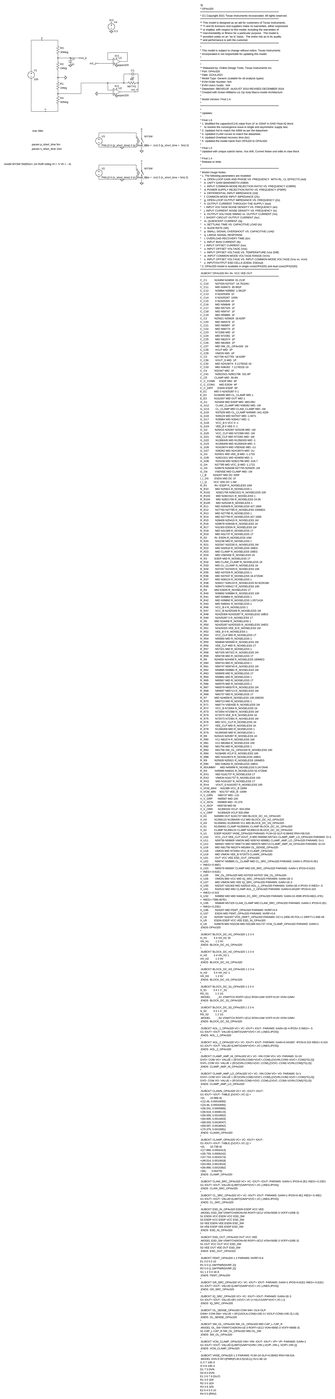
[diagram p0: schematic Isolation_detection_v1.asc, whole sheet]
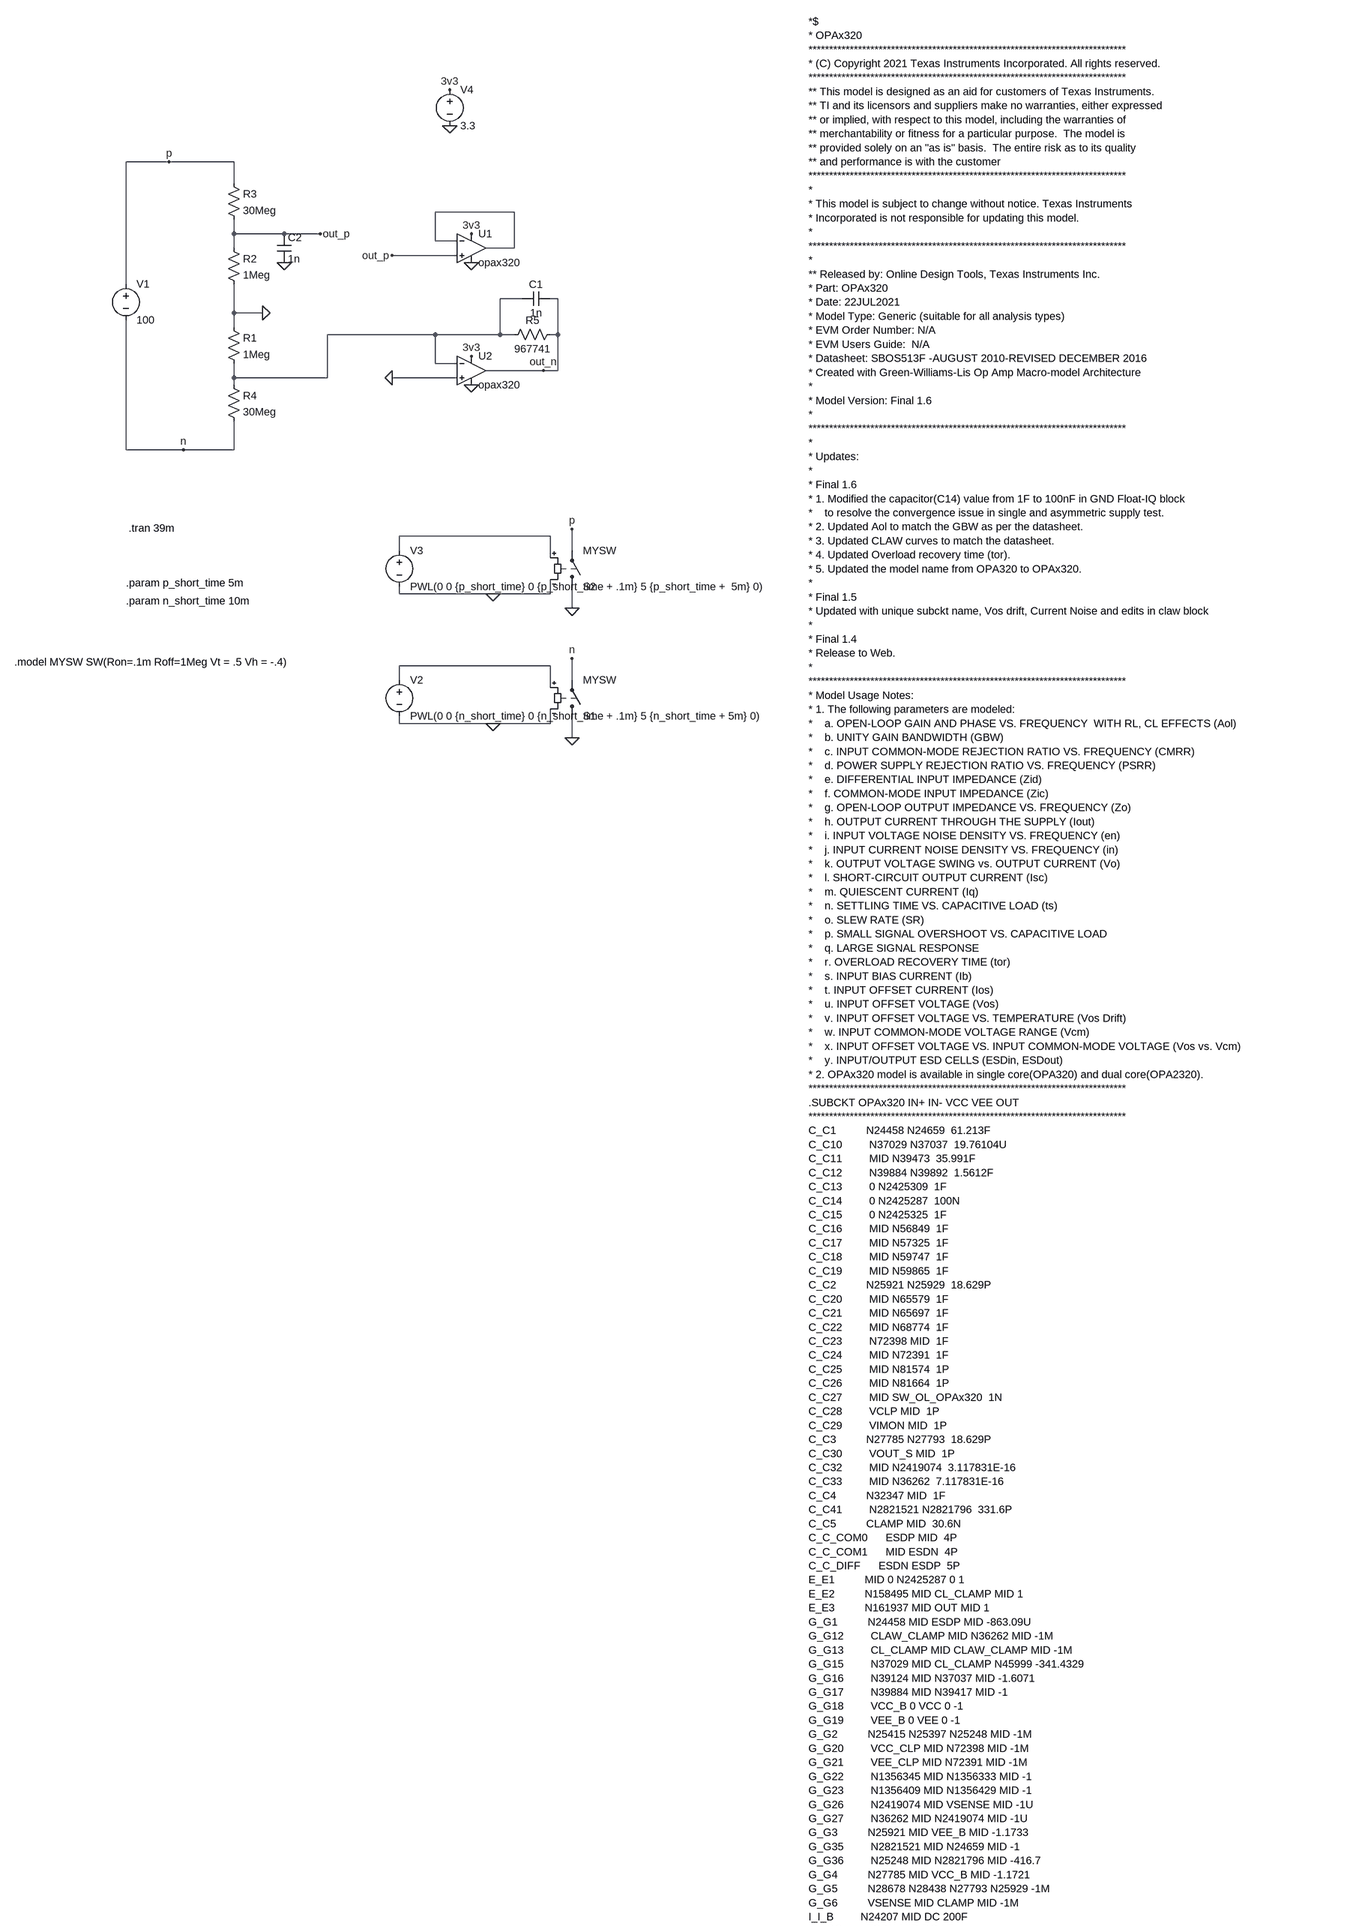
[diagram p1: schematic Isolation_detection_v1.asc, part, row 1 of 3, column 1 of 1]
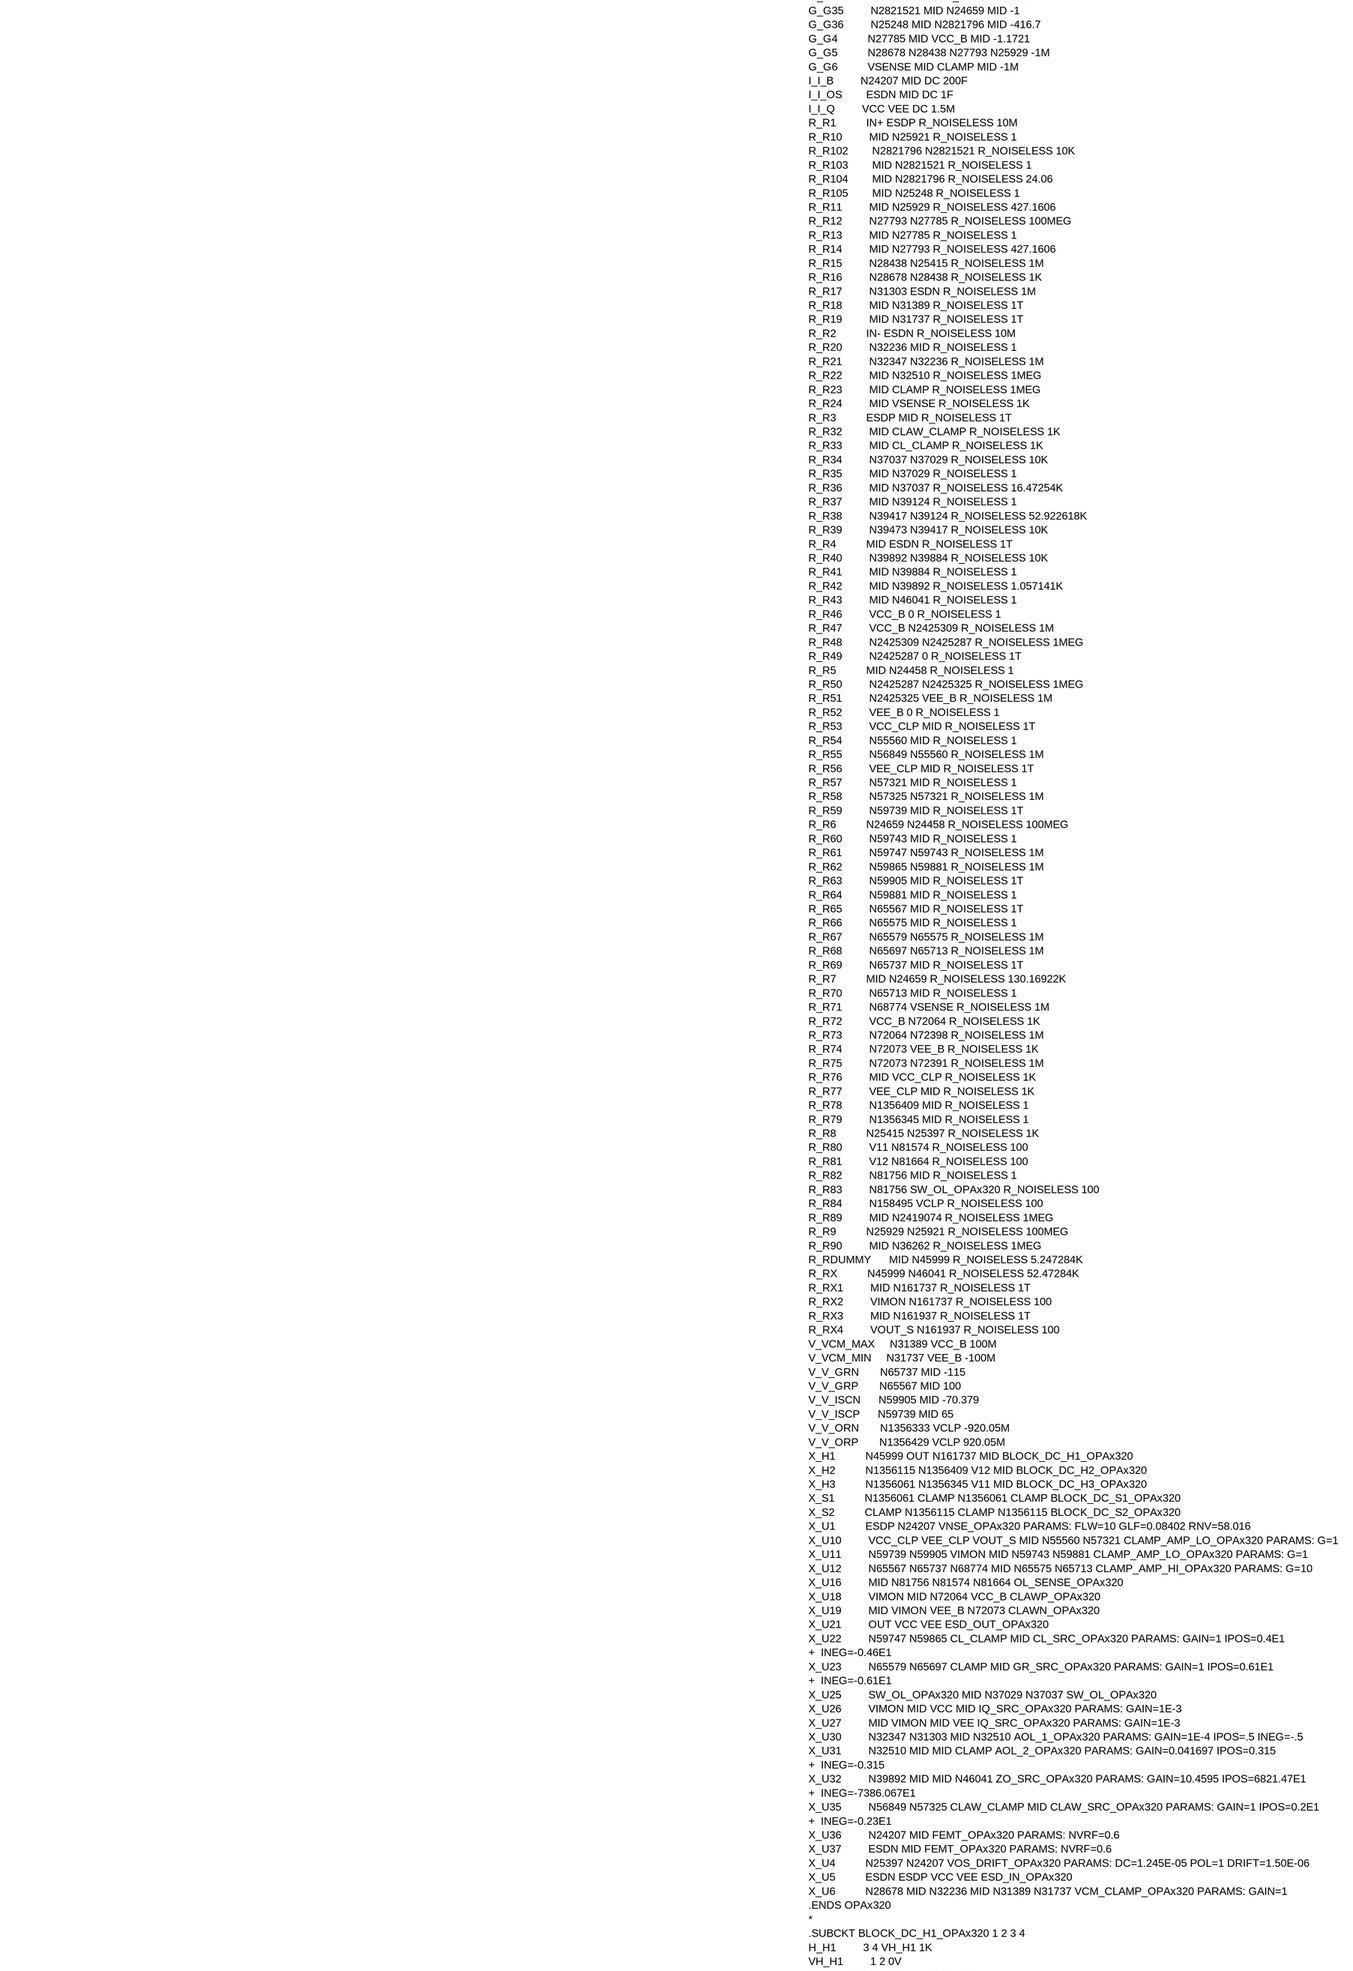
[diagram p2: schematic Isolation_detection_v1.asc, part, row 2 of 3, column 1 of 1]
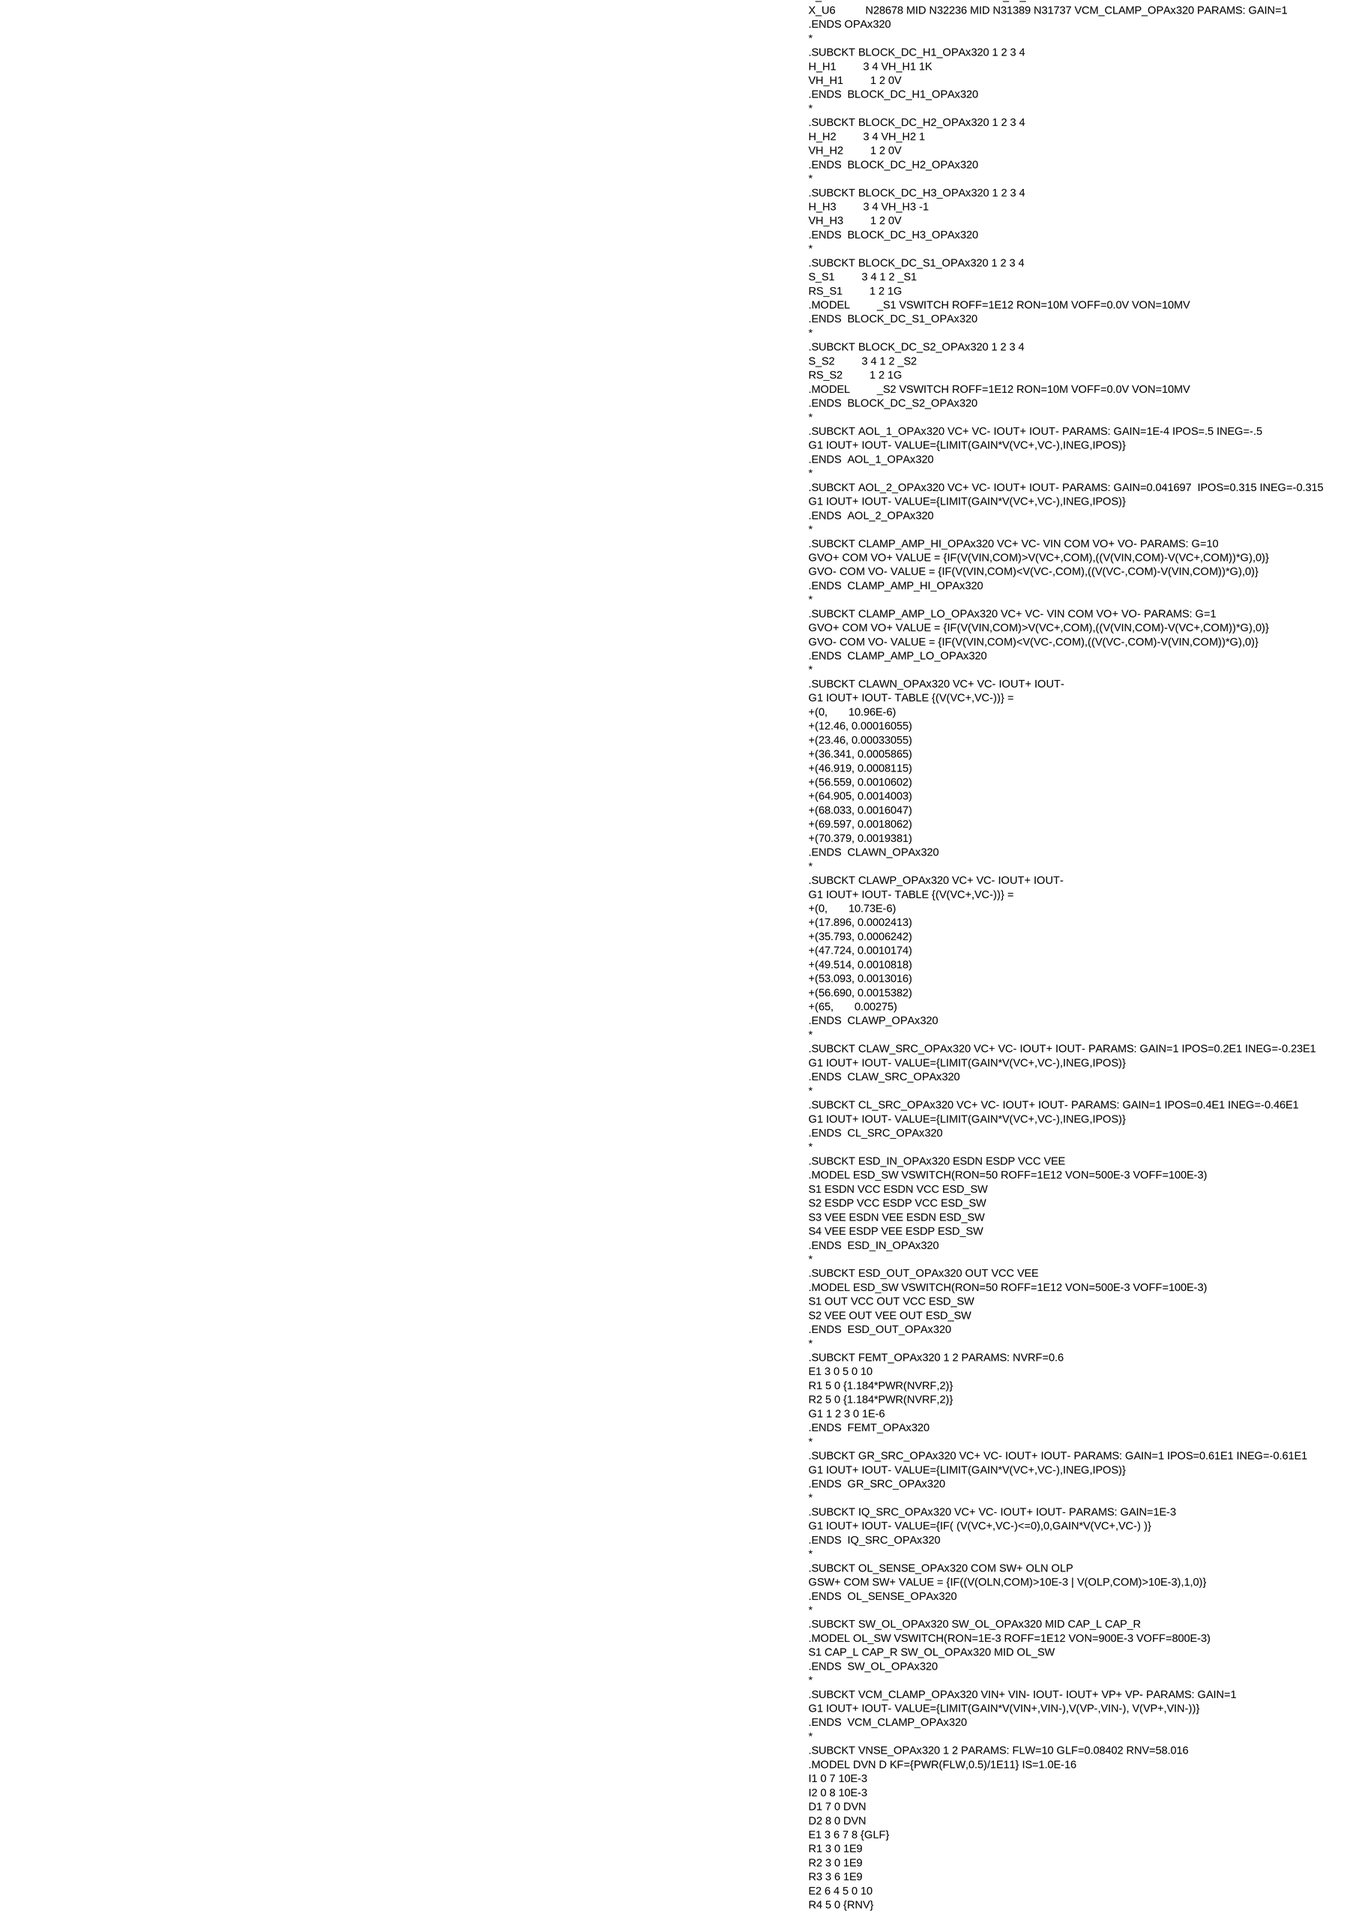
[diagram p3: schematic Isolation_detection_v1.asc, part, row 3 of 3, column 1 of 1]
Isolation_detection_v1.asc, the LTspice schematic file:
Version 4
SHEET 1 3172 11196
WIRE 272 -128 176 -128
WIRE 416 -128 272 -128
WIRE 416 -80 416 -128
WIRE 1040 -16 864 -16
WIRE 416 32 416 0
WIRE 528 32 416 32
WIRE 608 32 528 32
WIRE 864 48 864 -16
WIRE 912 48 864 48
WIRE 416 64 416 32
WIRE 1040 64 1040 -16
WIRE 1040 64 976 64
WIRE 912 80 768 80
WIRE 176 144 176 -128
WIRE 1056 176 1008 176
WIRE 1136 176 1120 176
WIRE 416 208 416 144
WIRE 480 208 416 208
WIRE 416 240 416 208
WIRE 864 256 624 256
WIRE 1008 256 1008 176
WIRE 1008 256 864 256
WIRE 1040 256 1008 256
WIRE 1136 256 1136 176
WIRE 1136 256 1120 256
WIRE 864 320 864 256
WIRE 912 320 864 320
WIRE 1104 336 976 336
WIRE 1136 336 1136 256
WIRE 1136 336 1104 336
WIRE 416 352 416 320
WIRE 624 352 624 256
WIRE 624 352 416 352
WIRE 912 352 768 352
WIRE 416 368 416 352
WIRE 176 512 176 224
WIRE 304 512 176 512
WIRE 416 512 416 448
WIRE 416 512 304 512
WIRE 1120 704 784 704
WIRE 784 736 784 704
WIRE 1168 736 1168 688
WIRE 1120 752 1120 704
WIRE 784 832 784 816
WIRE 992 832 784 832
WIRE 1120 832 1120 800
WIRE 1120 832 992 832
WIRE 1168 864 1168 816
WIRE 1120 992 784 992
WIRE 784 1024 784 992
WIRE 1168 1024 1168 976
WIRE 1120 1040 1120 992
WIRE 784 1120 784 1104
WIRE 992 1120 784 1120
WIRE 1120 1120 1120 1088
WIRE 1120 1120 992 1120
WIRE 1168 1152 1168 1104
FLAG 480 208 0
FLAG 608 32 out_p
FLAG 992 1120 0
FLAG 1168 1152 0
FLAG 992 832 0
FLAG 1168 864 0
FLAG 272 -128 p
FLAG 304 512 n
FLAG 1168 688 p
FLAG 1168 976 n
FLAG 944 96 0
FLAG 768 80 out_p
FLAG 896 -208 0
FLAG 896 -288 3v3
FLAG 944 32 3v3
FLAG 944 368 0
FLAG 944 304 3v3
FLAG 1104 336 out_n
FLAG 768 352 0
FLAG 528 96 0
SYMBOL voltage 176 128 R0
WINDOW 123 0 0 Left 0
WINDOW 39 0 0 Left 0
SYMATTR InstName V1
SYMATTR Value 100
SYMBOL res 400 224 R0
SYMATTR InstName R1
SYMATTR Value 1Meg
SYMBOL res 400 48 R0
SYMATTR InstName R2
SYMATTR Value 1Meg
SYMBOL res 400 -96 R0
SYMATTR InstName R3
SYMATTR Value 30Meg
SYMBOL res 400 352 R0
SYMATTR InstName R4
SYMATTR Value 30Meg
SYMBOL sw 1168 1120 M180
SYMATTR InstName S1
SYMATTR Value MYSW
SYMBOL voltage 784 1008 R0
WINDOW 123 0 0 Left 0
WINDOW 39 0 0 Left 0
SYMATTR InstName V2
SYMATTR Value PWL(0 0 {n_short_time} 0 {n_short_time + .1m} 5 {n_short_time + 5m} 0)
SYMBOL sw 1168 832 M180
SYMATTR InstName S2
SYMATTR Value MYSW
SYMBOL voltage 784 720 R0
WINDOW 123 0 0 Left 0
WINDOW 39 0 0 Left 0
SYMATTR InstName V3
SYMATTR Value PWL(0 0 {p_short_time} 0 {p_short_time + .1m} 5 {p_short_time +  5m} 0)
SYMBOL Opamps\\opamp2 944 0 R0
SYMATTR InstName U1
SYMATTR Value opax320
SYMBOL voltage 896 -304 R0
WINDOW 123 0 0 Left 0
WINDOW 39 0 0 Left 0
SYMATTR InstName V4
SYMATTR Value 3.3
SYMBOL Opamps\\opamp2 944 272 R0
SYMATTR InstName U2
SYMATTR Value opax320
SYMBOL res 1136 240 R90
WINDOW 0 0 56 VBottom 2
WINDOW 3 32 56 VTop 2
SYMATTR InstName R5
SYMATTR Value 967741
SYMBOL cap 512 32 R0
SYMATTR InstName C2
SYMATTR Value 1n
SYMBOL cap 1120 160 R90
WINDOW 0 0 32 VBottom 2
WINDOW 3 32 32 VTop 2
SYMATTR InstName C1
SYMATTR Value 1n
TEXT 182 686 Left 2 !.tran 39m
TEXT -72 984 Left 2 !.model MYSW SW(Ron=.1m Roff=1Meg Vt = .5 Vh = -.4)
TEXT 176 808 Left 2 !.param p_short_time 5m
TEXT 176 848 Left 2 !.param n_short_time 10m
TEXT 1904 -440 Left 2 !*$\n* OPAx320\n*****************************************************************************\n* (C) Copyright 2021 Texas Instruments Incorporated. All rights reserved.                                            \n*****************************************************************************\n** This model is designed as an aid for customers of Texas Instruments.\n** TI and its licensors and suppliers make no warranties, either expressed\n** or implied, with respect to this model, including the warranties of \n** merchantability or fitness for a particular purpose.  The model is\n** provided solely on an "as is" basis.  The entire risk as to its quality\n** and performance is with the customer\n*****************************************************************************\n*\n* This model is subject to change without notice. Texas Instruments\n* Incorporated is not responsible for updating this model.\n*\n*****************************************************************************\n*\n** Released by: Online Design Tools, Texas Instruments Inc.\n* Part: OPAx320\n* Date: 22JUL2021\n* Model Type: Generic (suitable for all analysis types)\n* EVM Order Number: N/A \n* EVM Users Guide:  N/A \n* Datasheet: SBOS513F -AUGUST 2010-REVISED DECEMBER 2016\n* Created with Green-Williams-Lis Op Amp Macro-model Architecture\n*\n* Model Version: Final 1.6\n*\n*****************************************************************************\n*\n* Updates:\n*\n* Final 1.6\n* 1. Modified the capacitor(C14) value from 1F to 100nF in GND Float-IQ block  \n*    to resolve the convergence issue in single and asymmetric supply test.\n* 2. Updated Aol to match the GBW as per the datasheet.\n* 3. Updated CLAW curves to match the datasheet.\n* 4. Updated Overload recovery time (tor).\n* 5. Updated the model name from OPA320 to OPAx320.\n*\n* Final 1.5\n* Updated with unique subckt name, Vos drift, Current Noise and edits in claw block\n*\n* Final 1.4\n* Release to Web.\n*\n*****************************************************************************\n* Model Usage Notes:\n* 1. The following parameters are modeled: \n*    a. OPEN-LOOP GAIN AND PHASE VS. FREQUENCY  WITH RL, CL EFFECTS (Aol)\n*    b. UNITY GAIN BANDWIDTH (GBW)\n*    c. INPUT COMMON-MODE REJECTION RATIO VS. FREQUENCY (CMRR)\n*    d. POWER SUPPLY REJECTION RATIO VS. FREQUENCY (PSRR)\n*    e. DIFFERENTIAL INPUT IMPEDANCE (Zid)\n*    f. COMMON-MODE INPUT IMPEDANCE (Zic)\n*    g. OPEN-LOOP OUTPUT IMPEDANCE VS. FREQUENCY (Zo)\n*    h. OUTPUT CURRENT THROUGH THE SUPPLY (Iout)\n*    i. INPUT VOLTAGE NOISE DENSITY VS. FREQUENCY (en)\n*    j. INPUT CURRENT NOISE DENSITY VS. FREQUENCY (in)\n*    k. OUTPUT VOLTAGE SWING vs. OUTPUT CURRENT (Vo)\n*    l. SHORT-CIRCUIT OUTPUT CURRENT (Isc)\n*    m. QUIESCENT CURRENT (Iq)\n*    n. SETTLING TIME VS. CAPACITIVE LOAD (ts)\n*    o. SLEW RATE (SR)\n*    p. SMALL SIGNAL OVERSHOOT VS. CAPACITIVE LOAD\n*    q. LARGE SIGNAL RESPONSE\n*    r. OVERLOAD RECOVERY TIME (tor)\n*    s. INPUT BIAS CURRENT (Ib)\n*    t. INPUT OFFSET CURRENT (Ios)\n*    u. INPUT OFFSET VOLTAGE (Vos)\n*    v. INPUT OFFSET VOLTAGE VS. TEMPERATURE (Vos Drift)\n*    w. INPUT COMMON-MODE VOLTAGE RANGE (Vcm)\n*    x. INPUT OFFSET VOLTAGE VS. INPUT COMMON-MODE VOLTAGE (Vos vs. Vcm)\n*    y. INPUT/OUTPUT ESD CELLS (ESDin, ESDout)\n* 2. OPAx320 model is available in single core(OPA320) and dual core(OPA2320). \n*****************************************************************************\n.SUBCKT OPAx320 IN+ IN- VCC VEE OUT  \n*****************************************************************************\nC_C1          N24458 N24659  61.213F   \nC_C10         N37029 N37037  19.76104U   \nC_C11         MID N39473  35.991F   \nC_C12         N39884 N39892  1.5612F   \nC_C13         0 N2425309  1F   \nC_C14         0 N2425287  100N   \nC_C15         0 N2425325  1F   \nC_C16         MID N56849  1F   \nC_C17         MID N57325  1F   \nC_C18         MID N59747  1F   \nC_C19         MID N59865  1F   \nC_C2          N25921 N25929  18.629P   \nC_C20         MID N65579  1F   \nC_C21         MID N65697  1F   \nC_C22         MID N68774  1F   \nC_C23         N72398 MID  1F   \nC_C24         MID N72391  1F   \nC_C25         MID N81574  1P   \nC_C26         MID N81664  1P   \nC_C27         MID SW_OL_OPAx320  1N   \nC_C28         VCLP MID  1P   \nC_C29         VIMON MID  1P   \nC_C3          N27785 N27793  18.629P   \nC_C30         VOUT_S MID  1P   \nC_C32         MID N2419074  3.117831E-16   \nC_C33         MID N36262  7.117831E-16   \nC_C4          N32347 MID  1F   \nC_C41         N2821521 N2821796  331.6P   \nC_C5          CLAMP MID  30.6N   \nC_C_COM0      ESDP MID  4P   \nC_C_COM1      MID ESDN  4P   \nC_C_DIFF      ESDN ESDP  5P   \nE_E1          MID 0 N2425287 0 1\nE_E2          N158495 MID CL_CLAMP MID 1\nE_E3          N161937 MID OUT MID 1\nG_G1          N24458 MID ESDP MID -863.09U\nG_G12         CLAW_CLAMP MID N36262 MID -1M\nG_G13         CL_CLAMP MID CLAW_CLAMP MID -1M\nG_G15         N37029 MID CL_CLAMP N45999 -341.4329\nG_G16         N39124 MID N37037 MID -1.6071\nG_G17         N39884 MID N39417 MID -1\nG_G18         VCC_B 0 VCC 0 -1\nG_G19         VEE_B 0 VEE 0 -1\nG_G2          N25415 N25397 N25248 MID -1M\nG_G20         VCC_CLP MID N72398 MID -1M\nG_G21         VEE_CLP MID N72391 MID -1M\nG_G22         N1356345 MID N1356333 MID -1\nG_G23         N1356409 MID N1356429 MID -1\nG_G26         N2419074 MID VSENSE MID -1U\nG_G27         N36262 MID N2419074 MID -1U\nG_G3          N25921 MID VEE_B MID -1.1733\nG_G35         N2821521 MID N24659 MID -1\nG_G36         N25248 MID N2821796 MID -416.7\nG_G4          N27785 MID VCC_B MID -1.1721\nG_G5          N28678 N28438 N27793 N25929 -1M\nG_G6          VSENSE MID CLAMP MID -1M\nI_I_B         N24207 MID DC 200F  \nI_I_OS        ESDN MID DC 1F  \nI_I_Q         VCC VEE DC 1.5M  \nR_R1          IN+ ESDP R_NOISELESS 10M\nR_R10         MID N25921 R_NOISELESS 1\nR_R102        N2821796 N2821521 R_NOISELESS 10K\nR_R103        MID N2821521 R_NOISELESS 1\nR_R104        MID N2821796 R_NOISELESS 24.06\nR_R105        MID N25248 R_NOISELESS 1\nR_R11         MID N25929 R_NOISELESS 427.1606\nR_R12         N27793 N27785 R_NOISELESS 100MEG\nR_R13         MID N27785 R_NOISELESS 1\nR_R14         MID N27793 R_NOISELESS 427.1606\nR_R15         N28438 N25415 R_NOISELESS 1M\nR_R16         N28678 N28438 R_NOISELESS 1K\nR_R17         N31303 ESDN R_NOISELESS 1M\nR_R18         MID N31389 R_NOISELESS 1T\nR_R19         MID N31737 R_NOISELESS 1T\nR_R2          IN- ESDN R_NOISELESS 10M\nR_R20         N32236 MID R_NOISELESS 1\nR_R21         N32347 N32236 R_NOISELESS 1M\nR_R22         MID N32510 R_NOISELESS 1MEG\nR_R23         MID CLAMP R_NOISELESS 1MEG\nR_R24         MID VSENSE R_NOISELESS 1K\nR_R3          ESDP MID R_NOISELESS 1T\nR_R32         MID CLAW_CLAMP R_NOISELESS 1K\nR_R33         MID CL_CLAMP R_NOISELESS 1K\nR_R34         N37037 N37029 R_NOISELESS 10K\nR_R35         MID N37029 R_NOISELESS 1\nR_R36         MID N37037 R_NOISELESS 16.47254K\nR_R37         MID N39124 R_NOISELESS 1\nR_R38         N39417 N39124 R_NOISELESS 52.922618K\nR_R39         N39473 N39417 R_NOISELESS 10K\nR_R4          MID ESDN R_NOISELESS 1T\nR_R40         N39892 N39884 R_NOISELESS 10K\nR_R41         MID N39884 R_NOISELESS 1\nR_R42         MID N39892 R_NOISELESS 1.057141K\nR_R43         MID N46041 R_NOISELESS 1\nR_R46         VCC_B 0 R_NOISELESS 1\nR_R47         VCC_B N2425309 R_NOISELESS 1M\nR_R48         N2425309 N2425287 R_NOISELESS 1MEG\nR_R49         N2425287 0 R_NOISELESS 1T\nR_R5          MID N24458 R_NOISELESS 1\nR_R50         N2425287 N2425325 R_NOISELESS 1MEG\nR_R51         N2425325 VEE_B R_NOISELESS 1M\nR_R52         VEE_B 0 R_NOISELESS 1\nR_R53         VCC_CLP MID R_NOISELESS 1T\nR_R54         N55560 MID R_NOISELESS 1\nR_R55         N56849 N55560 R_NOISELESS 1M\nR_R56         VEE_CLP MID R_NOISELESS 1T\nR_R57         N57321 MID R_NOISELESS 1\nR_R58         N57325 N57321 R_NOISELESS 1M\nR_R59         N59739 MID R_NOISELESS 1T\nR_R6          N24659 N24458 R_NOISELESS 100MEG\nR_R60         N59743 MID R_NOISELESS 1\nR_R61         N59747 N59743 R_NOISELESS 1M\nR_R62         N59865 N59881 R_NOISELESS 1M\nR_R63         N59905 MID R_NOISELESS 1T\nR_R64         N59881 MID R_NOISELESS 1\nR_R65         N65567 MID R_NOISELESS 1T\nR_R66         N65575 MID R_NOISELESS 1\nR_R67         N65579 N65575 R_NOISELESS 1M\nR_R68         N65697 N65713 R_NOISELESS 1M\nR_R69         N65737 MID R_NOISELESS 1T\nR_R7          MID N24659 R_NOISELESS 130.16922K\nR_R70         N65713 MID R_NOISELESS 1\nR_R71         N68774 VSENSE R_NOISELESS 1M\nR_R72         VCC_B N72064 R_NOISELESS 1K\nR_R73         N72064 N72398 R_NOISELESS 1M\nR_R74         N72073 VEE_B R_NOISELESS 1K\nR_R75         N72073 N72391 R_NOISELESS 1M\nR_R76         MID VCC_CLP R_NOISELESS 1K\nR_R77         VEE_CLP MID R_NOISELESS 1K\nR_R78         N1356409 MID R_NOISELESS 1\nR_R79         N1356345 MID R_NOISELESS 1\nR_R8          N25415 N25397 R_NOISELESS 1K\nR_R80         V11 N81574 R_NOISELESS 100\nR_R81         V12 N81664 R_NOISELESS 100\nR_R82         N81756 MID R_NOISELESS 1\nR_R83         N81756 SW_OL_OPAx320 R_NOISELESS 100\nR_R84         N158495 VCLP R_NOISELESS 100\nR_R89         MID N2419074 R_NOISELESS 1MEG\nR_R9          N25929 N25921 R_NOISELESS 100MEG\nR_R90         MID N36262 R_NOISELESS 1MEG\nR_RDUMMY      MID N45999 R_NOISELESS 5.247284K\nR_RX          N45999 N46041 R_NOISELESS 52.47284K\nR_RX1         MID N161737 R_NOISELESS 1T\nR_RX2         VIMON N161737 R_NOISELESS 100\nR_RX3         MID N161937 R_NOISELESS 1T\nR_RX4         VOUT_S N161937 R_NOISELESS 100\nV_VCM_MAX     N31389 VCC_B 100M\nV_VCM_MIN     N31737 VEE_B -100M\nV_V_GRN       N65737 MID -115\nV_V_GRP       N65567 MID 100\nV_V_ISCN      N59905 MID -70.379\nV_V_ISCP      N59739 MID 65\nV_V_ORN       N1356333 VCLP -920.05M\nV_V_ORP       N1356429 VCLP 920.05M\nX_H1          N45999 OUT N161737 MID BLOCK_DC_H1_OPAx320 \nX_H2          N1356115 N1356409 V12 MID BLOCK_DC_H2_OPAx320 \nX_H3          N1356061 N1356345 V11 MID BLOCK_DC_H3_OPAx320 \nX_S1          N1356061 CLAMP N1356061 CLAMP BLOCK_DC_S1_OPAx320 \nX_S2          CLAMP N1356115 CLAMP N1356115 BLOCK_DC_S2_OPAx320  \nX_U1          ESDP N24207 VNSE_OPAx320 PARAMS: FLW=10 GLF=0.08402 RNV=58.016\nX_U10         VCC_CLP VEE_CLP VOUT_S MID N55560 N57321 CLAMP_AMP_LO_OPAx320 PARAMS: G=1\nX_U11         N59739 N59905 VIMON MID N59743 N59881 CLAMP_AMP_LO_OPAx320 PARAMS: G=1\nX_U12         N65567 N65737 N68774 MID N65575 N65713 CLAMP_AMP_HI_OPAx320 PARAMS: G=10\nX_U16         MID N81756 N81574 N81664 OL_SENSE_OPAx320\nX_U18         VIMON MID N72064 VCC_B CLAWP_OPAx320\nX_U19         MID VIMON VEE_B N72073 CLAWN_OPAx320\nX_U21         OUT VCC VEE ESD_OUT_OPAx320\nX_U22         N59747 N59865 CL_CLAMP MID CL_SRC_OPAx320 PARAMS: GAIN=1 IPOS=0.4E1\n+  INEG=-0.46E1\nX_U23         N65579 N65697 CLAMP MID GR_SRC_OPAx320 PARAMS: GAIN=1 IPOS=0.61E1\n+  INEG=-0.61E1\nX_U25         SW_OL_OPAx320 MID N37029 N37037 SW_OL_OPAx320\nX_U26         VIMON MID VCC MID IQ_SRC_OPAx320 PARAMS: GAIN=1E-3\nX_U27         MID VIMON MID VEE IQ_SRC_OPAx320 PARAMS: GAIN=1E-3\nX_U30         N32347 N31303 MID N32510 AOL_1_OPAx320 PARAMS: GAIN=1E-4 IPOS=.5 INEG=-.5\nX_U31         N32510 MID MID CLAMP AOL_2_OPAx320 PARAMS: GAIN=0.041697 IPOS=0.315\n+  INEG=-0.315\nX_U32         N39892 MID MID N46041 ZO_SRC_OPAx320 PARAMS: GAIN=10.4595 IPOS=6821.47E1\n+  INEG=-7386.067E1\nX_U35         N56849 N57325 CLAW_CLAMP MID CLAW_SRC_OPAx320 PARAMS: GAIN=1 IPOS=0.2E1\n+  INEG=-0.23E1\nX_U36         N24207 MID FEMT_OPAx320 PARAMS: NVRF=0.6\nX_U37         ESDN MID FEMT_OPAx320 PARAMS: NVRF=0.6\nX_U4          N25397 N24207 VOS_DRIFT_OPAx320 PARAMS: DC=1.245E-05 POL=1 DRIFT=1.50E-06\nX_U5          ESDN ESDP VCC VEE ESD_IN_OPAx320\nX_U6          N28678 MID N32236 MID N31389 N31737 VCM_CLAMP_OPAx320 PARAMS: GAIN=1\n.ENDS OPAx320\n*\n.SUBCKT BLOCK_DC_H1_OPAx320 1 2 3 4  \nH_H1         3 4 VH_H1 1K\nVH_H1         1 2 0V\n.ENDS  BLOCK_DC_H1_OPAx320\n*\n.SUBCKT BLOCK_DC_H2_OPAx320 1 2 3 4  \nH_H2         3 4 VH_H2 1\nVH_H2         1 2 0V\n.ENDS  BLOCK_DC_H2_OPAx320\n*\n.SUBCKT BLOCK_DC_H3_OPAx320 1 2 3 4  \nH_H3         3 4 VH_H3 -1\nVH_H3         1 2 0V\n.ENDS  BLOCK_DC_H3_OPAx320\n*\n.SUBCKT BLOCK_DC_S1_OPAx320 1 2 3 4  \nS_S1         3 4 1 2 _S1\nRS_S1         1 2 1G\n.MODEL         _S1 VSWITCH ROFF=1E12 RON=10M VOFF=0.0V VON=10MV\n.ENDS  BLOCK_DC_S1_OPAx320\n*\n.SUBCKT BLOCK_DC_S2_OPAx320 1 2 3 4  \nS_S2         3 4 1 2 _S2\nRS_S2         1 2 1G\n.MODEL         _S2 VSWITCH ROFF=1E12 RON=10M VOFF=0.0V VON=10MV\n.ENDS  BLOCK_DC_S2_OPAx320\n*\n.SUBCKT AOL_1_OPAx320 VC+ VC- IOUT+ IOUT- PARAMS: GAIN=1E-4 IPOS=.5 INEG=-.5\nG1 IOUT+ IOUT- VALUE={LIMIT(GAIN*V(VC+,VC-),INEG,IPOS)}\n.ENDS  AOL_1_OPAx320\n*\n.SUBCKT AOL_2_OPAx320 VC+ VC- IOUT+ IOUT- PARAMS: GAIN=0.041697  IPOS=0.315 INEG=-0.315\nG1 IOUT+ IOUT- VALUE={LIMIT(GAIN*V(VC+,VC-),INEG,IPOS)}\n.ENDS  AOL_2_OPAx320\n*\n.SUBCKT CLAMP_AMP_HI_OPAx320 VC+ VC- VIN COM VO+ VO- PARAMS: G=10\nGVO+ COM VO+ VALUE = {IF(V(VIN,COM)>V(VC+,COM),((V(VIN,COM)-V(VC+,COM))*G),0)}\nGVO- COM VO- VALUE = {IF(V(VIN,COM)<V(VC-,COM),((V(VC-,COM)-V(VIN,COM))*G),0)}\n.ENDS  CLAMP_AMP_HI_OPAx320\n*\n.SUBCKT CLAMP_AMP_LO_OPAx320 VC+ VC- VIN COM VO+ VO- PARAMS: G=1\nGVO+ COM VO+ VALUE = {IF(V(VIN,COM)>V(VC+,COM),((V(VIN,COM)-V(VC+,COM))*G),0)}\nGVO- COM VO- VALUE = {IF(V(VIN,COM)<V(VC-,COM),((V(VC-,COM)-V(VIN,COM))*G),0)}\n.ENDS  CLAMP_AMP_LO_OPAx320\n*\n.SUBCKT CLAWN_OPAx320 VC+ VC- IOUT+ IOUT-\nG1 IOUT+ IOUT- TABLE {(V(VC+,VC-))} =\n+(0,       10.96E-6)\n+(12.46, 0.00016055)\n+(23.46, 0.00033055)\n+(36.341, 0.0005865)\n+(46.919, 0.0008115)\n+(56.559, 0.0010602)\n+(64.905, 0.0014003)\n+(68.033, 0.0016047)\n+(69.597, 0.0018062)\n+(70.379, 0.0019381)\n.ENDS  CLAWN_OPAx320\n*\n.SUBCKT CLAWP_OPAx320 VC+ VC- IOUT+ IOUT-\nG1 IOUT+ IOUT- TABLE {(V(VC+,VC-))} =\n+(0,       10.73E-6)\n+(17.896, 0.0002413)\n+(35.793, 0.0006242)\n+(47.724, 0.0010174)\n+(49.514, 0.0010818)\n+(53.093, 0.0013016)\n+(56.690, 0.0015382)\n+(65,       0.00275)\n.ENDS  CLAWP_OPAx320\n*\n.SUBCKT CLAW_SRC_OPAx320 VC+ VC- IOUT+ IOUT- PARAMS: GAIN=1 IPOS=0.2E1 INEG=-0.23E1\nG1 IOUT+ IOUT- VALUE={LIMIT(GAIN*V(VC+,VC-),INEG,IPOS)}\n.ENDS  CLAW_SRC_OPAx320\n*\n.SUBCKT CL_SRC_OPAx320 VC+ VC- IOUT+ IOUT- PARAMS: GAIN=1 IPOS=0.4E1 INEG=-0.46E1\nG1 IOUT+ IOUT- VALUE={LIMIT(GAIN*V(VC+,VC-),INEG,IPOS)}\n.ENDS  CL_SRC_OPAx320\n*\n.SUBCKT ESD_IN_OPAx320 ESDN ESDP VCC VEE\n.MODEL ESD_SW VSWITCH(RON=50 ROFF=1E12 VON=500E-3 VOFF=100E-3)\nS1 ESDN VCC ESDN VCC ESD_SW\nS2 ESDP VCC ESDP VCC ESD_SW\nS3 VEE ESDN VEE ESDN ESD_SW\nS4 VEE ESDP VEE ESDP ESD_SW\n.ENDS  ESD_IN_OPAx320\n*\n.SUBCKT ESD_OUT_OPAx320 OUT VCC VEE\n.MODEL ESD_SW VSWITCH(RON=50 ROFF=1E12 VON=500E-3 VOFF=100E-3)\nS1 OUT VCC OUT VCC ESD_SW\nS2 VEE OUT VEE OUT ESD_SW\n.ENDS  ESD_OUT_OPAx320\n*\n.SUBCKT FEMT_OPAx320 1 2 PARAMS: NVRF=0.6\nE1 3 0 5 0 10\nR1 5 0 {1.184*PWR(NVRF,2)}\nR2 5 0 {1.184*PWR(NVRF,2)}\nG1 1 2 3 0 1E-6\n.ENDS  FEMT_OPAx320\n*\n.SUBCKT GR_SRC_OPAx320 VC+ VC- IOUT+ IOUT- PARAMS: GAIN=1 IPOS=0.61E1 INEG=-0.61E1\nG1 IOUT+ IOUT- VALUE={LIMIT(GAIN*V(VC+,VC-),INEG,IPOS)}\n.ENDS  GR_SRC_OPAx320\n*\n.SUBCKT IQ_SRC_OPAx320 VC+ VC- IOUT+ IOUT- PARAMS: GAIN=1E-3\nG1 IOUT+ IOUT- VALUE={IF( (V(VC+,VC-)<=0),0,GAIN*V(VC+,VC-) )}\n.ENDS  IQ_SRC_OPAx320\n*\n.SUBCKT OL_SENSE_OPAx320 COM SW+ OLN OLP\nGSW+ COM SW+ VALUE = {IF((V(OLN,COM)>10E-3 | V(OLP,COM)>10E-3),1,0)}\n.ENDS  OL_SENSE_OPAx320\n*\n.SUBCKT SW_OL_OPAx320 SW_OL_OPAx320 MID CAP_L CAP_R\n.MODEL OL_SW VSWITCH(RON=1E-3 ROFF=1E12 VON=900E-3 VOFF=800E-3)\nS1 CAP_L CAP_R SW_OL_OPAx320 MID OL_SW\n.ENDS  SW_OL_OPAx320\n*\n.SUBCKT VCM_CLAMP_OPAx320 VIN+ VIN- IOUT- IOUT+ VP+ VP- PARAMS: GAIN=1\nG1 IOUT+ IOUT- VALUE={LIMIT(GAIN*V(VIN+,VIN-),V(VP-,VIN-), V(VP+,VIN-))}\n.ENDS  VCM_CLAMP_OPAx320\n*\n.SUBCKT VNSE_OPAx320 1 2 PARAMS: FLW=10 GLF=0.08402 RNV=58.016\n.MODEL DVN D KF={PWR(FLW,0.5)/1E11} IS=1.0E-16\nI1 0 7 10E-3\nI2 0 8 10E-3\nD1 7 0 DVN\nD2 8 0 DVN\nE1 3 6 7 8 {GLF}\nR1 3 0 1E9\nR2 3 0 1E9\nR3 3 6 1E9\nE2 6 4 5 0 10\nR4 5 0 {RNV}\nR5 5 0 {RNV}\nR6 3 4 1E9\nR7 4 0 1E9\nE3 1 2 3 4 1\n.ENDS  VNSE_OPAx320\n*\n.SUBCKT VOS_DRIFT_OPAx320 VOS+ VOS- PARAMS: DC=1.243E-05 POL=1 DRIFT=1.50E-06\nE1 VOS+ VOS- VALUE={DC+POL*DRIFT*(TEMP-27)}\n.ENDS  VOS_DRIFT_OPAx320\n*\n.SUBCKT ZO_SRC_OPAx320 VC+ VC- IOUT+ IOUT- PARAMS: GAIN=10.4595 IPOS=6821.47E1 INEG=-7386.067E1\nG1 IOUT+ IOUT- VALUE={LIMIT(GAIN*V(VC+,VC-),INEG,IPOS)}\n.ENDS  ZO_SRC_OPAx320\n*\n.MODEL R_NOISELESS RES (T_ABS=-273.15)\n*

The netlist it stands for:
* Isolation_detection_v1.asc
V1 p n 100
R1 0 N002 1Meg
R2 out_p 0 1Meg
R3 p out_p 30Meg
R4 N002 n 30Meg
S1 0 n N004 0 MYSW
V2 N004 0 PWL(0 0 {n_short_time} 0 {n_short_time + .1m} 5 {n_short_time + 5m} 0)
S2 0 p N003 0 MYSW
V3 N003 0 PWL(0 0 {p_short_time} 0 {p_short_time + .1m} 5 {p_short_time +  5m} 0)
XU1 out_p N001 3v3 0 N001 opax320  ; pins In+ In- V+ V- OUT
V4 3v3 0 3.3
XU2 0 N002 3v3 0 out_n opax320  ; pins In+ In- V+ V- OUT
R5 out_n N002 967741
C2 out_p 0 1n
C1 out_n N002 1n
.tran 39m
.model MYSW SW(Ron=.1m Roff=1Meg Vt = .5 Vh = -.4)
.param p_short_time 5m
.param n_short_time 10m
*$
* OPAx320
*****************************************************************************
* (C) Copyright 2021 Texas Instruments Incorporated. All rights reserved.
*****************************************************************************
** This model is designed as an aid for customers of Texas Instruments.
** TI and its licensors and suppliers make no warranties, either expressed
** or implied, with respect to this model, including the warranties of
** merchantability or fitness for a particular purpose.  The model is
** provided solely on an "as is" basis.  The entire risk as to its quality
** and performance is with the customer
*****************************************************************************
*
* This model is subject to change without notice. Texas Instruments
* Incorporated is not responsible for updating this model.
*
*****************************************************************************
*
** Released by: Online Design Tools, Texas Instruments Inc.
* Part: OPAx320
* Date: 22JUL2021
* Model Type: Generic (suitable for all analysis types)
* EVM Order Number: N/A
* EVM Users Guide:  N/A
* Datasheet: SBOS513F -AUGUST 2010-REVISED DECEMBER 2016
* Created with Green-Williams-Lis Op Amp Macro-model Architecture
*
* Model Version: Final 1.6
*
*****************************************************************************
*
* Updates:
*
* Final 1.6
* 1. Modified the capacitor(C14) value from 1F to 100nF in GND Float-IQ block
*    to resolve the convergence issue in single and asymmetric supply test.
* 2. Updated Aol to match the GBW as per the datasheet.
* 3. Updated CLAW curves to match the datasheet.
* 4. Updated Overload recovery time (tor).
* 5. Updated the model name from OPA320 to OPAx320.
*
* Final 1.5
* Updated with unique subckt name, Vos drift, Current Noise and edits in claw block
*
* Final 1.4
* Release to Web.
*
*****************************************************************************
* Model Usage Notes:
* 1. The following parameters are modeled:
*    a. OPEN-LOOP GAIN AND PHASE VS. FREQUENCY  WITH RL, CL EFFECTS (Aol)
*    b. UNITY GAIN BANDWIDTH (GBW)
*    c. INPUT COMMON-MODE REJECTION RATIO VS. FREQUENCY (CMRR)
*    d. POWER SUPPLY REJECTION RATIO VS. FREQUENCY (PSRR)
*    e. DIFFERENTIAL INPUT IMPEDANCE (Zid)
*    f. COMMON-MODE INPUT IMPEDANCE (Zic)
*    g. OPEN-LOOP OUTPUT IMPEDANCE VS. FREQUENCY (Zo)
*    h. OUTPUT CURRENT THROUGH THE SUPPLY (Iout)
*    i. INPUT VOLTAGE NOISE DENSITY VS. FREQUENCY (en)
*    j. INPUT CURRENT NOISE DENSITY VS. FREQUENCY (in)
*    k. OUTPUT VOLTAGE SWING vs. OUTPUT CURRENT (Vo)
*    l. SHORT-CIRCUIT OUTPUT CURRENT (Isc)
*    m. QUIESCENT CURRENT (Iq)
*    n. SETTLING TIME VS. CAPACITIVE LOAD (ts)
*    o. SLEW RATE (SR)
*    p. SMALL SIGNAL OVERSHOOT VS. CAPACITIVE LOAD
*    q. LARGE SIGNAL RESPONSE
*    r. OVERLOAD RECOVERY TIME (tor)
*    s. INPUT BIAS CURRENT (Ib)
*    t. INPUT OFFSET CURRENT (Ios)
*    u. INPUT OFFSET VOLTAGE (Vos)
*    v. INPUT OFFSET VOLTAGE VS. TEMPERATURE (Vos Drift)
*    w. INPUT COMMON-MODE VOLTAGE RANGE (Vcm)
*    x. INPUT OFFSET VOLTAGE VS. INPUT COMMON-MODE VOLTAGE (Vos vs. Vcm)
*    y. INPUT/OUTPUT ESD CELLS (ESDin, ESDout)
* 2. OPAx320 model is available in single core(OPA320) and dual core(OPA2320).
*****************************************************************************
.SUBCKT OPAx320 IN+ IN- VCC VEE OUT
*****************************************************************************
C_C1          N24458 N24659  61.213F
C_C10         N37029 N37037  19.76104U
C_C11         MID N39473  35.991F
C_C12         N39884 N39892  1.5612F
C_C13         0 N2425309  1F
C_C14         0 N2425287  100N
C_C15         0 N2425325  1F
C_C16         MID N56849  1F
C_C17         MID N57325  1F
C_C18         MID N59747  1F
C_C19         MID N59865  1F
C_C2          N25921 N25929  18.629P
C_C20         MID N65579  1F
C_C21         MID N65697  1F
C_C22         MID N68774  1F
C_C23         N72398 MID  1F
C_C24         MID N72391  1F
C_C25         MID N81574  1P
C_C26         MID N81664  1P
C_C27         MID SW_OL_OPAx320  1N
C_C28         VCLP MID  1P
C_C29         VIMON MID  1P
C_C3          N27785 N27793  18.629P
C_C30         VOUT_S MID  1P
C_C32         MID N2419074  3.117831E-16
C_C33         MID N36262  7.117831E-16
C_C4          N32347 MID  1F
C_C41         N2821521 N2821796  331.6P
C_C5          CLAMP MID  30.6N
C_C_COM0      ESDP MID  4P
C_C_COM1      MID ESDN  4P
C_C_DIFF      ESDN ESDP  5P
E_E1          MID 0 N2425287 0 1
E_E2          N158495 MID CL_CLAMP MID 1
E_E3          N161937 MID OUT MID 1
G_G1          N24458 MID ESDP MID -863.09U
G_G12         CLAW_CLAMP MID N36262 MID -1M
G_G13         CL_CLAMP MID CLAW_CLAMP MID -1M
G_G15         N37029 MID CL_CLAMP N45999 -341.4329
G_G16         N39124 MID N37037 MID -1.6071
G_G17         N39884 MID N39417 MID -1
G_G18         VCC_B 0 VCC 0 -1
G_G19         VEE_B 0 VEE 0 -1
G_G2          N25415 N25397 N25248 MID -1M
G_G20         VCC_CLP MID N72398 MID -1M
G_G21         VEE_CLP MID N72391 MID -1M
G_G22         N1356345 MID N1356333 MID -1
G_G23         N1356409 MID N1356429 MID -1
G_G26         N2419074 MID VSENSE MID -1U
G_G27         N36262 MID N2419074 MID -1U
G_G3          N25921 MID VEE_B MID -1.1733
G_G35         N2821521 MID N24659 MID -1
G_G36         N25248 MID N2821796 MID -416.7
G_G4          N27785 MID VCC_B MID -1.1721
G_G5          N28678 N28438 N27793 N25929 -1M
G_G6          VSENSE MID CLAMP MID -1M
I_I_B         N24207 MID DC 200F
I_I_OS        ESDN MID DC 1F
I_I_Q         VCC VEE DC 1.5M
R_R1          IN+ ESDP R_NOISELESS 10M
R_R10         MID N25921 R_NOISELESS 1
R_R102        N2821796 N2821521 R_NOISELESS 10K
R_R103        MID N2821521 R_NOISELESS 1
R_R104        MID N2821796 R_NOISELESS 24.06
R_R105        MID N25248 R_NOISELESS 1
R_R11         MID N25929 R_NOISELESS 427.1606
R_R12         N27793 N27785 R_NOISELESS 100MEG
R_R13         MID N27785 R_NOISELESS 1
R_R14         MID N27793 R_NOISELESS 427.1606
R_R15         N28438 N25415 R_NOISELESS 1M
R_R16         N28678 N28438 R_NOISELESS 1K
R_R17         N31303 ESDN R_NOISELESS 1M
R_R18         MID N31389 R_NOISELESS 1T
R_R19         MID N31737 R_NOISELESS 1T
R_R2          IN- ESDN R_NOISELESS 10M
R_R20         N32236 MID R_NOISELESS 1
R_R21         N32347 N32236 R_NOISELESS 1M
R_R22         MID N32510 R_NOISELESS 1MEG
R_R23         MID CLAMP R_NOISELESS 1MEG
R_R24         MID VSENSE R_NOISELESS 1K
R_R3          ESDP MID R_NOISELESS 1T
R_R32         MID CLAW_CLAMP R_NOISELESS 1K
R_R33         MID CL_CLAMP R_NOISELESS 1K
R_R34         N37037 N37029 R_NOISELESS 10K
R_R35         MID N37029 R_NOISELESS 1
R_R36         MID N37037 R_NOISELESS 16.47254K
R_R37         MID N39124 R_NOISELESS 1
R_R38         N39417 N39124 R_NOISELESS 52.922618K
R_R39         N39473 N39417 R_NOISELESS 10K
R_R4          MID ESDN R_NOISELESS 1T
R_R40         N39892 N39884 R_NOISELESS 10K
R_R41         MID N39884 R_NOISELESS 1
R_R42         MID N39892 R_NOISELESS 1.057141K
R_R43         MID N46041 R_NOISELESS 1
R_R46         VCC_B 0 R_NOISELESS 1
R_R47         VCC_B N2425309 R_NOISELESS 1M
R_R48         N2425309 N2425287 R_NOISELESS 1MEG
R_R49         N2425287 0 R_NOISELESS 1T
R_R5          MID N24458 R_NOISELESS 1
R_R50         N2425287 N2425325 R_NOISELESS 1MEG
R_R51         N2425325 VEE_B R_NOISELESS 1M
R_R52         VEE_B 0 R_NOISELESS 1
R_R53         VCC_CLP MID R_NOISELESS 1T
R_R54         N55560 MID R_NOISELESS 1
R_R55         N56849 N55560 R_NOISELESS 1M
R_R56         VEE_CLP MID R_NOISELESS 1T
R_R57         N57321 MID R_NOISELESS 1
R_R58         N57325 N57321 R_NOISELESS 1M
R_R59         N59739 MID R_NOISELESS 1T
R_R6          N24659 N24458 R_NOISELESS 100MEG
R_R60         N59743 MID R_NOISELESS 1
R_R61         N59747 N59743 R_NOISELESS 1M
R_R62         N59865 N59881 R_NOISELESS 1M
R_R63         N59905 MID R_NOISELESS 1T
R_R64         N59881 MID R_NOISELESS 1
R_R65         N65567 MID R_NOISELESS 1T
R_R66         N65575 MID R_NOISELESS 1
R_R67         N65579 N65575 R_NOISELESS 1M
R_R68         N65697 N65713 R_NOISELESS 1M
R_R69         N65737 MID R_NOISELESS 1T
R_R7          MID N24659 R_NOISELESS 130.16922K
R_R70         N65713 MID R_NOISELESS 1
R_R71         N68774 VSENSE R_NOISELESS 1M
R_R72         VCC_B N72064 R_NOISELESS 1K
R_R73         N72064 N72398 R_NOISELESS 1M
R_R74         N72073 VEE_B R_NOISELESS 1K
R_R75         N72073 N72391 R_NOISELESS 1M
R_R76         MID VCC_CLP R_NOISELESS 1K
R_R77         VEE_CLP MID R_NOISELESS 1K
R_R78         N1356409 MID R_NOISELESS 1
R_R79         N1356345 MID R_NOISELESS 1
R_R8          N25415 N25397 R_NOISELESS 1K
R_R80         V11 N81574 R_NOISELESS 100
R_R81         V12 N81664 R_NOISELESS 100
R_R82         N81756 MID R_NOISELESS 1
R_R83         N81756 SW_OL_OPAx320 R_NOISELESS 100
R_R84         N158495 VCLP R_NOISELESS 100
R_R89         MID N2419074 R_NOISELESS 1MEG
R_R9          N25929 N25921 R_NOISELESS 100MEG
R_R90         MID N36262 R_NOISELESS 1MEG
R_RDUMMY      MID N45999 R_NOISELESS 5.247284K
R_RX          N45999 N46041 R_NOISELESS 52.47284K
R_RX1         MID N161737 R_NOISELESS 1T
R_RX2         VIMON N161737 R_NOISELESS 100
R_RX3         MID N161937 R_NOISELESS 1T
R_RX4         VOUT_S N161937 R_NOISELESS 100
V_VCM_MAX     N31389 VCC_B 100M
V_VCM_MIN     N31737 VEE_B -100M
V_V_GRN       N65737 MID -115
V_V_GRP       N65567 MID 100
V_V_ISCN      N59905 MID -70.379
V_V_ISCP      N59739 MID 65
V_V_ORN       N1356333 VCLP -920.05M
V_V_ORP       N1356429 VCLP 920.05M
X_H1          N45999 OUT N161737 MID BLOCK_DC_H1_OPAx320
X_H2          N1356115 N1356409 V12 MID BLOCK_DC_H2_OPAx320
X_H3          N1356061 N1356345 V11 MID BLOCK_DC_H3_OPAx320
X_S1          N1356061 CLAMP N1356061 CLAMP BLOCK_DC_S1_OPAx320
X_S2          CLAMP N1356115 CLAMP N1356115 BLOCK_DC_S2_OPAx320
X_U1          ESDP N24207 VNSE_OPAx320 PARAMS: FLW=10 GLF=0.08402 RNV=58.016
X_U10         VCC_CLP VEE_CLP VOUT_S MID N55560 N57321 CLAMP_AMP_LO_OPAx320 PARAMS: G=1
X_U11         N59739 N59905 VIMON MID N59743 N59881 CLAMP_AMP_LO_OPAx320 PARAMS: G=1
X_U12         N65567 N65737 N68774 MID N65575 N65713 CLAMP_AMP_HI_OPAx320 PARAMS: G=10
X_U16         MID N81756 N81574 N81664 OL_SENSE_OPAx320
X_U18         VIMON MID N72064 VCC_B CLAWP_OPAx320
X_U19         MID VIMON VEE_B N72073 CLAWN_OPAx320
X_U21         OUT VCC VEE ESD_OUT_OPAx320
X_U22         N59747 N59865 CL_CLAMP MID CL_SRC_OPAx320 PARAMS: GAIN=1 IPOS=0.4E1
+  INEG=-0.46E1
X_U23         N65579 N65697 CLAMP MID GR_SRC_OPAx320 PARAMS: GAIN=1 IPOS=0.61E1
+  INEG=-0.61E1
X_U25         SW_OL_OPAx320 MID N37029 N37037 SW_OL_OPAx320
X_U26         VIMON MID VCC MID IQ_SRC_OPAx320 PARAMS: GAIN=1E-3
X_U27         MID VIMON MID VEE IQ_SRC_OPAx320 PARAMS: GAIN=1E-3
X_U30         N32347 N31303 MID N32510 AOL_1_OPAx320 PARAMS: GAIN=1E-4 IPOS=.5 INEG=-.5
X_U31         N32510 MID MID CLAMP AOL_2_OPAx320 PARAMS: GAIN=0.041697 IPOS=0.315
+  INEG=-0.315
X_U32         N39892 MID MID N46041 ZO_SRC_OPAx320 PARAMS: GAIN=10.4595 IPOS=6821.47E1
+  INEG=-7386.067E1
X_U35         N56849 N57325 CLAW_CLAMP MID CLAW_SRC_OPAx320 PARAMS: GAIN=1 IPOS=0.2E1
+  INEG=-0.23E1
X_U36         N24207 MID FEMT_OPAx320 PARAMS: NVRF=0.6
X_U37         ESDN MID FEMT_OPAx320 PARAMS: NVRF=0.6
X_U4          N25397 N24207 VOS_DRIFT_OPAx320 PARAMS: DC=1.245E-05 POL=1 DRIFT=1.50E-06
X_U5          ESDN ESDP VCC VEE ESD_IN_OPAx320
X_U6          N28678 MID N32236 MID N31389 N31737 VCM_CLAMP_OPAx320 PARAMS: GAIN=1
.ENDS OPAx320
*
.SUBCKT BLOCK_DC_H1_OPAx320 1 2 3 4
H_H1         3 4 VH_H1 1K
VH_H1         1 2 0V
.ENDS  BLOCK_DC_H1_OPAx320
*
.SUBCKT BLOCK_DC_H2_OPAx320 1 2 3 4
H_H2         3 4 VH_H2 1
VH_H2         1 2 0V
.ENDS  BLOCK_DC_H2_OPAx320
*
.SUBCKT BLOCK_DC_H3_OPAx320 1 2 3 4
H_H3         3 4 VH_H3 -1
VH_H3         1 2 0V
.ENDS  BLOCK_DC_H3_OPAx320
*
.SUBCKT BLOCK_DC_S1_OPAx320 1 2 3 4
S_S1         3 4 1 2 _S1
RS_S1         1 2 1G
.MODEL         _S1 VSWITCH ROFF=1E12 RON=10M VOFF=0.0V VON=10MV
.ENDS  BLOCK_DC_S1_OPAx320
*
.SUBCKT BLOCK_DC_S2_OPAx320 1 2 3 4
S_S2         3 4 1 2 _S2
RS_S2         1 2 1G
.MODEL         _S2 VSWITCH ROFF=1E12 RON=10M VOFF=0.0V VON=10MV
.ENDS  BLOCK_DC_S2_OPAx320
*
.SUBCKT AOL_1_OPAx320 VC+ VC- IOUT+ IOUT- PARAMS: GAIN=1E-4 IPOS=.5 INEG=-.5
G1 IOUT+ IOUT- VALUE={LIMIT(GAIN*V(VC+,VC-),INEG,IPOS)}
.ENDS  AOL_1_OPAx320
*
.SUBCKT AOL_2_OPAx320 VC+ VC- IOUT+ IOUT- PARAMS: GAIN=0.041697  IPOS=0.315 INEG=-0.315
G1 IOUT+ IOUT- VALUE={LIMIT(GAIN*V(VC+,VC-),INEG,IPOS)}
.ENDS  AOL_2_OPAx320
*
.SUBCKT CLAMP_AMP_HI_OPAx320 VC+ VC- VIN COM VO+ VO- PARAMS: G=10
GVO+ COM VO+ VALUE = {IF(V(VIN,COM)>V(VC+,COM),((V(VIN,COM)-V(VC+,COM))*G),0)}
GVO- COM VO- VALUE = {IF(V(VIN,COM)<V(VC-,COM),((V(VC-,COM)-V(VIN,COM))*G),0)}
.ENDS  CLAMP_AMP_HI_OPAx320
*
.SUBCKT CLAMP_AMP_LO_OPAx320 VC+ VC- VIN COM VO+ VO- PARAMS: G=1
GVO+ COM VO+ VALUE = {IF(V(VIN,COM)>V(VC+,COM),((V(VIN,COM)-V(VC+,COM))*G),0)}
GVO- COM VO- VALUE = {IF(V(VIN,COM)<V(VC-,COM),((V(VC-,COM)-V(VIN,COM))*G),0)}
.ENDS  CLAMP_AMP_LO_OPAx320
*
.SUBCKT CLAWN_OPAx320 VC+ VC- IOUT+ IOUT-
G1 IOUT+ IOUT- TABLE {(V(VC+,VC-))} =
+(0,       10.96E-6)
+(12.46, 0.00016055)
+(23.46, 0.00033055)
+(36.341, 0.0005865)
+(46.919, 0.0008115)
+(56.559, 0.0010602)
+(64.905, 0.0014003)
+(68.033, 0.0016047)
+(69.597, 0.0018062)
+(70.379, 0.0019381)
.ENDS  CLAWN_OPAx320
*
.SUBCKT CLAWP_OPAx320 VC+ VC- IOUT+ IOUT-
G1 IOUT+ IOUT- TABLE {(V(VC+,VC-))} =
+(0,       10.73E-6)
+(17.896, 0.0002413)
+(35.793, 0.0006242)
+(47.724, 0.0010174)
+(49.514, 0.0010818)
+(53.093, 0.0013016)
+(56.690, 0.0015382)
+(65,       0.00275)
.ENDS  CLAWP_OPAx320
*
.SUBCKT CLAW_SRC_OPAx320 VC+ VC- IOUT+ IOUT- PARAMS: GAIN=1 IPOS=0.2E1 INEG=-0.23E1
G1 IOUT+ IOUT- VALUE={LIMIT(GAIN*V(VC+,VC-),INEG,IPOS)}
.ENDS  CLAW_SRC_OPAx320
*
.SUBCKT CL_SRC_OPAx320 VC+ VC- IOUT+ IOUT- PARAMS: GAIN=1 IPOS=0.4E1 INEG=-0.46E1
G1 IOUT+ IOUT- VALUE={LIMIT(GAIN*V(VC+,VC-),INEG,IPOS)}
.ENDS  CL_SRC_OPAx320
*
.SUBCKT ESD_IN_OPAx320 ESDN ESDP VCC VEE
.MODEL ESD_SW VSWITCH(RON=50 ROFF=1E12 VON=500E-3 VOFF=100E-3)
S1 ESDN VCC ESDN VCC ESD_SW
S2 ESDP VCC ESDP VCC ESD_SW
S3 VEE ESDN VEE ESDN ESD_SW
S4 VEE ESDP VEE ESDP ESD_SW
.ENDS  ESD_IN_OPAx320
*
.SUBCKT ESD_OUT_OPAx320 OUT VCC VEE
.MODEL ESD_SW VSWITCH(RON=50 ROFF=1E12 VON=500E-3 VOFF=100E-3)
S1 OUT VCC OUT VCC ESD_SW
S2 VEE OUT VEE OUT ESD_SW
.ENDS  ESD_OUT_OPAx320
*
.SUBCKT FEMT_OPAx320 1 2 PARAMS: NVRF=0.6
E1 3 0 5 0 10
R1 5 0 {1.184*PWR(NVRF,2)}
R2 5 0 {1.184*PWR(NVRF,2)}
G1 1 2 3 0 1E-6
.ENDS  FEMT_OPAx320
*
.SUBCKT GR_SRC_OPAx320 VC+ VC- IOUT+ IOUT- PARAMS: GAIN=1 IPOS=0.61E1 INEG=-0.61E1
G1 IOUT+ IOUT- VALUE={LIMIT(GAIN*V(VC+,VC-),INEG,IPOS)}
.ENDS  GR_SRC_OPAx320
*
.SUBCKT IQ_SRC_OPAx320 VC+ VC- IOUT+ IOUT- PARAMS: GAIN=1E-3
G1 IOUT+ IOUT- VALUE={IF( (V(VC+,VC-)<=0),0,GAIN*V(VC+,VC-) )}
.ENDS  IQ_SRC_OPAx320
*
.SUBCKT OL_SENSE_OPAx320 COM SW+ OLN OLP
GSW+ COM SW+ VALUE = {IF((V(OLN,COM)>10E-3 | V(OLP,COM)>10E-3),1,0)}
.ENDS  OL_SENSE_OPAx320
*
.SUBCKT SW_OL_OPAx320 SW_OL_OPAx320 MID CAP_L CAP_R
.MODEL OL_SW VSWITCH(RON=1E-3 ROFF=1E12 VON=900E-3 VOFF=800E-3)
S1 CAP_L CAP_R SW_OL_OPAx320 MID OL_SW
.ENDS  SW_OL_OPAx320
*
.SUBCKT VCM_CLAMP_OPAx320 VIN+ VIN- IOUT- IOUT+ VP+ VP- PARAMS: GAIN=1
G1 IOUT+ IOUT- VALUE={LIMIT(GAIN*V(VIN+,VIN-),V(VP-,VIN-), V(VP+,VIN-))}
.ENDS  VCM_CLAMP_OPAx320
*
.SUBCKT VNSE_OPAx320 1 2 PARAMS: FLW=10 GLF=0.08402 RNV=58.016
.MODEL DVN D KF={PWR(FLW,0.5)/1E11} IS=1.0E-16
I1 0 7 10E-3
I2 0 8 10E-3
D1 7 0 DVN
D2 8 0 DVN
E1 3 6 7 8 {GLF}
R1 3 0 1E9
R2 3 0 1E9
R3 3 6 1E9
E2 6 4 5 0 10
R4 5 0 {RNV}
R5 5 0 {RNV}
R6 3 4 1E9
R7 4 0 1E9
E3 1 2 3 4 1
.ENDS  VNSE_OPAx320
*
.SUBCKT VOS_DRIFT_OPAx320 VOS+ VOS- PARAMS: DC=1.243E-05 POL=1 DRIFT=1.50E-06
E1 VOS+ VOS- VALUE={DC+POL*DRIFT*(TEMP-27)}
.ENDS  VOS_DRIFT_OPAx320
*
.SUBCKT ZO_SRC_OPAx320 VC+ VC- IOUT+ IOUT- PARAMS: GAIN=10.4595 IPOS=6821.47E1 INEG=-7386.067E1
G1 IOUT+ IOUT- VALUE={LIMIT(GAIN*V(VC+,VC-),INEG,IPOS)}
.ENDS  ZO_SRC_OPAx320
*
.MODEL R_NOISELESS RES (T_ABS=-273.15)
*
.backanno
.end